# Altium project Rotary Encoder.PrjPcb
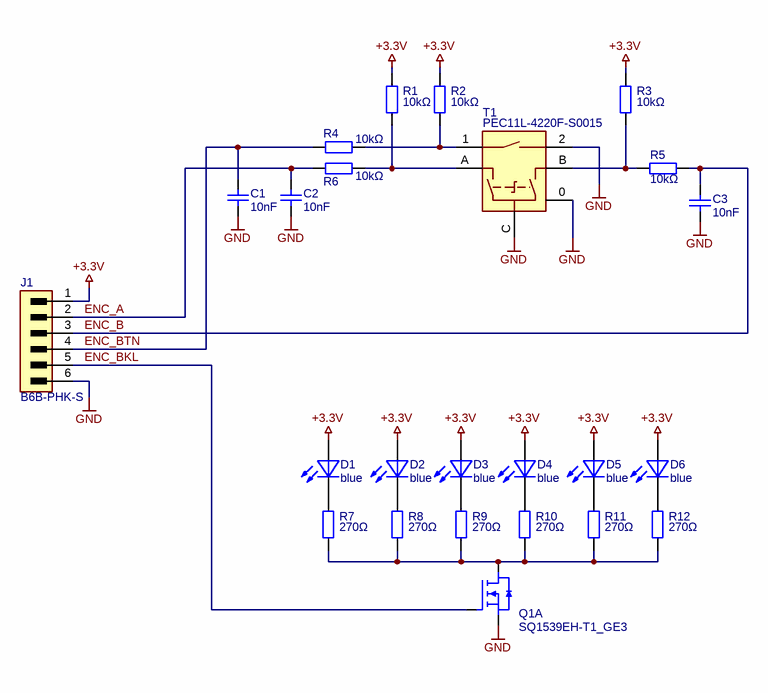
[diagram p0: Rotary Encoder.SchDoc]
Revision: 1.1; ProjectName: Encoder; ProjectAuthors: Klossner, Lüthi
1 sheet, 24 parts. Net scope: global (net labels, ports and power ports of the same name join across sheets).
Board file: Rotary Encoder.PcbDoc

## Sheet Rotary Encoder.SchDoc
size A4; Date: 27.05.2014; DrawnBy: luths8; Organization: BFH; Address1: Bern University of Applied Sciences; Address2: Engineering and Information Technology; Address3: Jlcoweg 1; Address4: CH-3400 Burgdorf; DocumentNumber: 1; Revision: 1.0; SheetNumber: 1; SheetTotal: 1; CurrentDate: 27.05.2014

### Parts
C1  10nF  [SMD0603CAP]
C2  10nF  [SMD0603CAP]
C3  10nF  [SMD0603CAP]
D1  blue  [LED]
D2  blue  [LED]
D3  blue  [LED]
D4  blue  [LED]
D5  blue  [LED]
D6  blue  [LED]
J1  B6B-PHK-S  [B6B-PH-K-S]
Q1  SQ1539EH-T1_GE3  [SOT-363-6]  (part A of 2)
R1  10kΩ  [SMD0603RES]
R2  10kΩ  [SMD0603RES]
R3  10kΩ  [SMD0603RES]
R4  10kΩ  [SMD0603RES]
R5  10kΩ  [SMD0603RES]
R6  10kΩ  [SMD0603RES]
R7  270Ω  [SMD0603RES]
R8  270Ω  [SMD0603RES]
R9  270Ω  [SMD0603RES]
R10  270Ω  [SMD0603RES]
R11  270Ω  [SMD0603RES]
R12  270Ω  [SMD0603RES]
T1  PEC11L-4220F-S0015  [PEC11L-4220F-S0015]

### Nets
+3.3V: D1.A D2.A D3.A D4.A D5.A D6.A J1.1 R1.1 R2.1 R3.1
GND: C1.2(q) C2.2(q) C3.2(q) J1.6 Q1.1(S) T1.0 T1.2 T1.C
ENC_A: C2.1 J1.2 R6.1
ENC_B: C3.1 J1.3 R5.1
ENC_BKL: J1.5 Q1.2(G)
ENC_BTN: C1.1 J1.4 R4.1
NetD1_C: D1.C R7.2
NetD2_C: D2.C R8.2
NetD3_C: D3.C R9.2
NetD4_C: D4.C R10.2
NetD5_C: D5.C R11.2
NetD6_C: D6.C R12.2
NetQ1_6: Q1.6(D) R7.1 R8.1 R9.1 R10.1 R11.1 R12.1
NetR1_2: R1.2 R6.2 T1.A
NetR2_2: R2.2 R4.2 T1.1
NetR3_2: R3.2 R5.2 T1.B

### Notes on the sheet
- Project:
- Size:
- Sheet:
- Title:
- A4
- of
- Drawn by:
- Revision:
- Date:
- Variant:
- b
- File:

### Library data of the parts
C1-C3 = Capacitor Ceramic: Ceramic Capacitor; Voltage: *
D1-D6 = LED red: Manufacturer Part No.: LB M673-M1N2-35-Z
J1 = Connector 6x1P: Manufacturer Part No.: B6B-PHK-S; System: Connector
Q1 = Transistor N/PMOS Dual: Transistor Dual, NMOS & PMOS; Manufacturer Part No.: SQ1539EH-T1_GE3
R1-R12 = Resistor
T1 = Rotary Encoder: Rotary Encoder with button; Manufacturer Part No.: PEC11L-4220F-S0015